# Altium schematic sheet LED matrix.SchDoc: Megabit LED Matrix
size A4; DocumentNumber: 2; Revision: 1; SheetNumber: 2; SheetTotal: 3
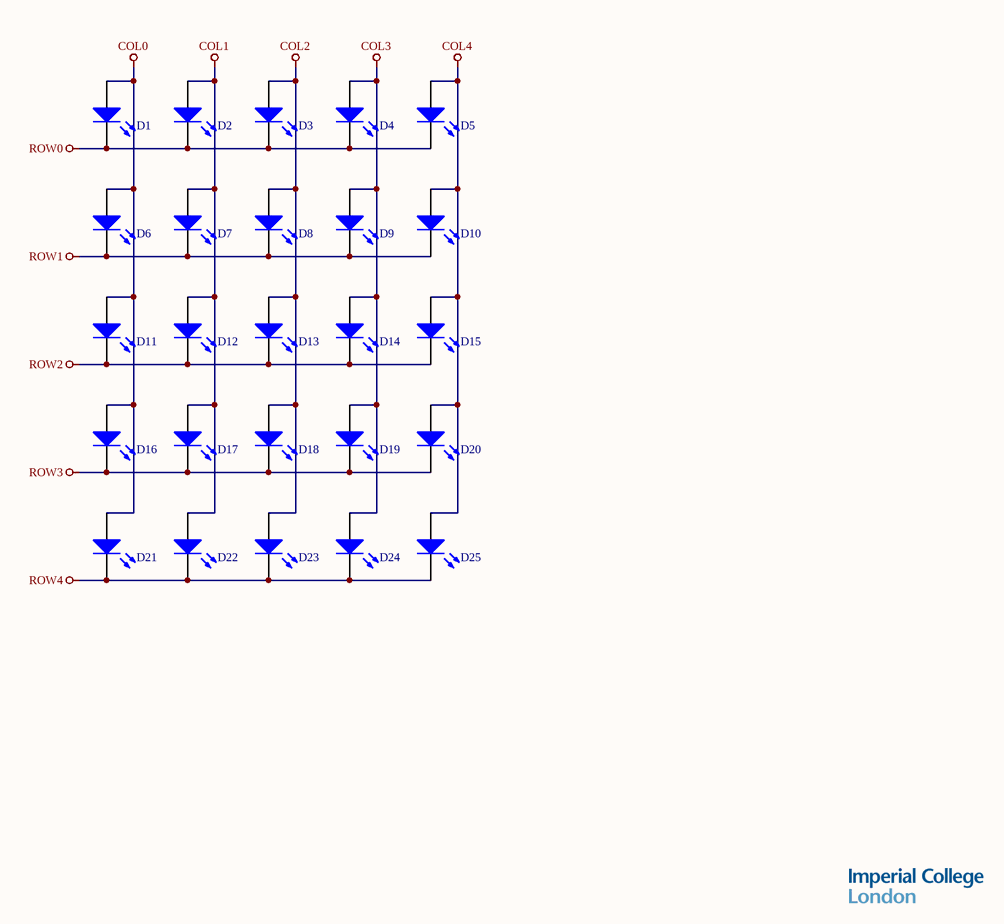
[diagram p0: LED matrix.SchDoc]

## Parts
D1  LED  [PCB-pjce6c538hbnjhyboevm-1]  (value not drawn)
D2  LED  [PCB-pjce6c538hbnjhyboevm-1]  (value not drawn)
D3  LED  [PCB-pjce6c538hbnjhyboevm-1]  (value not drawn)
D4  LED  [PCB-pjce6c538hbnjhyboevm-1]  (value not drawn)
D5  LED  [PCB-pjce6c538hbnjhyboevm-1]  (value not drawn)
D6  LED  [PCB-pjce6c538hbnjhyboevm-1]  (value not drawn)
D7  LED  [PCB-pjce6c538hbnjhyboevm-1]  (value not drawn)
D8  LED  [PCB-pjce6c538hbnjhyboevm-1]  (value not drawn)
D9  LED  [PCB-pjce6c538hbnjhyboevm-1]  (value not drawn)
D10  LED  [PCB-pjce6c538hbnjhyboevm-1]  (value not drawn)
D11  LED  [PCB-pjce6c538hbnjhyboevm-1]  (value not drawn)
D12  LED  [PCB-pjce6c538hbnjhyboevm-1]  (value not drawn)
D13  LED  [PCB-pjce6c538hbnjhyboevm-1]  (value not drawn)
D14  LED  [PCB-pjce6c538hbnjhyboevm-1]  (value not drawn)
D15  LED  [PCB-pjce6c538hbnjhyboevm-1]  (value not drawn)
D16  LED  [PCB-pjce6c538hbnjhyboevm-1]  (value not drawn)
D17  LED  [PCB-pjce6c538hbnjhyboevm-1]  (value not drawn)
D18  LED  [PCB-pjce6c538hbnjhyboevm-1]  (value not drawn)
D19  LED  [PCB-pjce6c538hbnjhyboevm-1]  (value not drawn)
D20  LED  [PCB-pjce6c538hbnjhyboevm-1]  (value not drawn)
D21  LED  [PCB-pjce6c538hbnjhyboevm-1]  (value not drawn)
D22  LED  [PCB-pjce6c538hbnjhyboevm-1]  (value not drawn)
D23  LED  [PCB-pjce6c538hbnjhyboevm-1]  (value not drawn)
D24  LED  [PCB-pjce6c538hbnjhyboevm-1]  (value not drawn)
D25  LED  [PCB-pjce6c538hbnjhyboevm-1]  (value not drawn)

## Nets
COL0: D1.1(A) D6.1(A) D11.1(A) D16.1(A) D21.1(A)
COL1: D2.1(A) D7.1(A) D12.1(A) D17.1(A) D22.1(A)
COL2: D3.1(A) D8.1(A) D13.1(A) D18.1(A) D23.1(A)
COL3: D4.1(A) D9.1(A) D14.1(A) D19.1(A) D24.1(A)
COL4: D5.1(A) D10.1(A) D15.1(A) D20.1(A) D25.1(A)
ROW0: D1.2(K) D2.2(K) D3.2(K) D4.2(K) D5.2(K)
ROW1: D6.2(K) D7.2(K) D8.2(K) D9.2(K) D10.2(K)
ROW2: D11.2(K) D12.2(K) D13.2(K) D14.2(K) D15.2(K)
ROW3: D16.2(K) D17.2(K) D18.2(K) D19.2(K) D20.2(K)
ROW4: D21.2(K) D22.2(K) D23.2(K) D24.2(K) D25.2(K)

## Notes on the sheet
- Title
- Size:
- Date:
- A4
- Number:
- Time:
- Revision:
- Sheet
- of
- File:

## Library data of the parts
D1-D25 = CMP-c7440e1cac271883-2: L-793SRD-E, Round Series Red LED, 640 nm 8 mm, Round Lens Through Hole package; Lens Type: Diffused; Viewing Angle: 30 °; Wavelength: 640 nm; Octopart URL: https://octopart.com/l-793srd-e-kingbright-5393925; Operating Temperature: -40.0 °C to 85.0 °C; RoHS: Compliant; Mounting Style: Through Hole, PCB; REACH SVHC Compliance: No SVHC; Manufacturer Part Number: L-793SRD-E